# Altium project PCB_Project1.PrjPCB
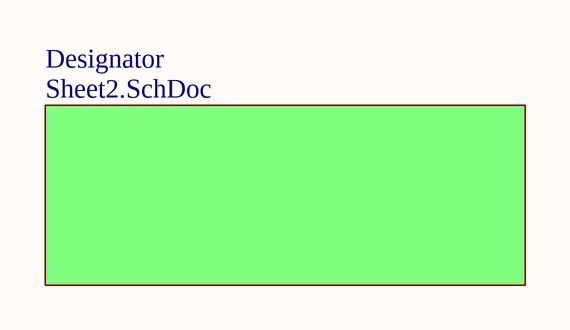
[diagram p0: Sheet1.SchDoc]
2 sheets, 10 parts. Net scope: global (net labels, ports and power ports of the same name join across sheets).
Board file: PCB1.PcbDoc
Sheets:
  Sheet1.SchDoc
    Designator = Sheet2.SchDoc

## Sheet Sheet1.SchDoc
size A4

### Sub-sheets
Designator = Sheet2.SchDoc: no entries

## Sheet Sheet2.SchDoc
size A4
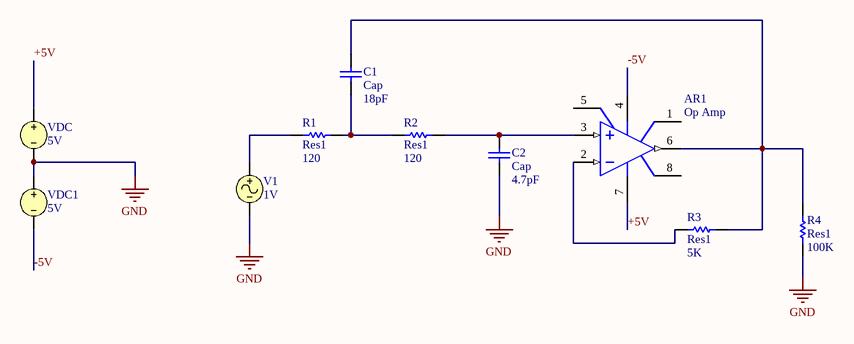
[diagram p1: Sheet2.SchDoc]

### Parts
AR1  Op Amp  [H-08A]
C1  Cap  value 18pF  [RAD-0.3]
C2  Cap  value 4.7pF  [RAD-0.3]
R1  Res1  value 120  [AXIAL-0.3]
R2  Res1  value 120  [AXIAL-0.3]
R3  Res1  value 5K  [AXIAL-0.3]
R4  Res1  value 100K  [AXIAL-0.3]
V1  1V
VDC  5V
VDC1  5V

### Nets
GND: C2.1 R4.1 V1.2 VDC.2 VDC1.1
+5V: AR1.7(V+) VDC.1
-5V: AR1.4(V-) VDC1.2
NetAR1_2: AR1.2(IN-) R3.1
NetAR1_3: AR1.3(IN+) C2.2 R2.2
NetAR1_6: AR1.6(OUT) C1.2 R3.2 R4.2
NetC1_1: C1.1 R1.2 R2.1
NetR1_1: R1.1 V1.1

Not connected (* = marked no-connect by the designer): AR1 1(OS_NUL) 5(OS_NUL) 8(TAB)

### Library data of the parts
AR1 = Op Amp: FET Operational Amplifier; Published: 8-Jun-2000; LatestRevisionDate: 17-Jul-2002; LatestRevisionNote: Re-released for DXP Platform.; DatasheetVersion: REV. B; PackageVersion: 1990; PackageReference: H-08A; Publisher: Altium Limited; PackageDescription: Can; 8 Leads; Pin Circle Dia. 5.08 mm; Lead Dia. 0.53 mm (max); ComponentLink1Description: Manufacturer Link; ComponentLink1URL: http://www.analog.com/
C1 C2 = Cap: Capacitor; Published: 8-Jun-2000; LatestRevisionDate: 17-Jul-2002; LatestRevisionNote: Re-released for DXP Platform.; PackageReference: RAD-0.3; Publisher: Altium Limited; PackageDescription: Radial Cap, Thru-Hole; 2 Leads; 0.3 in Pin Spacing
R1-R4 = Res1: Resistor; Published: 8-Jun-2000; LatestRevisionDate: 17-Jul-2002; LatestRevisionNote: Re-released for DXP Platform.; PackageReference: AXIAL-0.3; Publisher: Altium Limited; PackageDescription: Axial Device, Thru-Hole; 2 Leads; 0.3 in Pin Spacing
V1 = VSIN: Sinusoidal Voltage Source; Note: PCB Footprint - Not required; Published: 8-Jun-2000; LatestRevisionDate: 15-Nov-2004; LatestRevisionNote: Corrected Netlist.; PackageReference: Not Applicable; Publisher: Altium Limited
VDC VDC1 = VSRC: Voltage Source; Note: PCB Footprint - Not required; Published: 8-Jun-2000; LatestRevisionDate: 17-Jul-2002; LatestRevisionNote: Re-released for DXP Platform.; PackageReference: Not Applicable; Publisher: Altium Limited